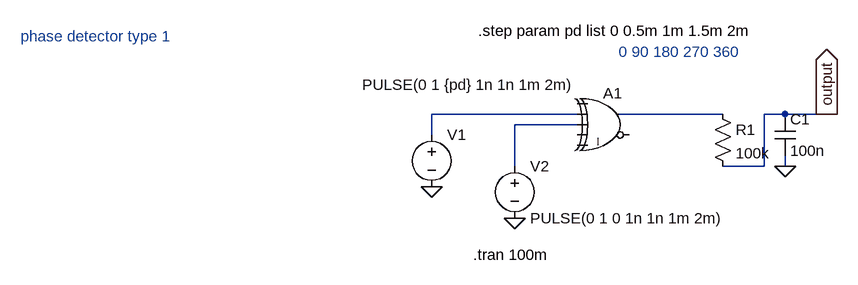
[diagram p0: schematic phasedetector1.asc]
phasedetector1.asc, the LTspice schematic file:
Version 4
SHEET 1 880 680
WIRE 160 128 -64 128
WIRE 384 128 224 128
WIRE 480 128 448 128
WIRE 544 128 480 128
WIRE 560 128 544 128
WIRE 160 144 64 144
WIRE -64 160 -64 128
WIRE 64 208 64 144
WIRE 448 208 448 128
WIRE 448 208 384 208
WIRE 480 208 480 192
FLAG 480 208 0
FLAG 544 128 output
IOPIN 544 128 Out
FLAG -64 240 0
FLAG 64 288 0
SYMBOL Digital\\xor 208 80 R0
SYMATTR InstName A1
SYMBOL voltage -64 144 R0
WINDOW 3 -107 -61 Left 2
WINDOW 123 0 0 Left 0
WINDOW 39 0 0 Left 0
SYMATTR InstName V1
SYMATTR Value PULSE(0 1 {pd} 1n 1n 1m 2m)
SYMBOL voltage 64 192 R0
WINDOW 123 0 0 Left 0
WINDOW 39 0 0 Left 0
SYMATTR InstName V2
SYMATTR Value PULSE(0 1 0 1n 1n 1m 2m)
SYMBOL res 368 112 R0
SYMATTR InstName R1
SYMATTR Value 100k
SYMBOL cap 464 128 R0
SYMATTR InstName C1
SYMATTR Value 100n
TEXT 8 0 Left 2 !.step param pd list 0 0.5m 1m 1.5m 2m
TEXT 0 344 Left 2 !.tran 100m
TEXT -696 8 Left 2 ;phase detector type 1
TEXT 224 32 Left 2 ;0 90 180 270 360

The netlist it stands for:
* phasedetector1.asc
A1 0 N001 N003 0 0 0 N002 0 XOR
V1 N001 0 PULSE(0 1 {pd} 1n 1n 1m 2m)
V2 N003 0 PULSE(0 1 0 1n 1n 1m 2m)
R1 N002 output 100k
C1 output 0 100n
.step param pd list 0 0.5m 1m 1.5m 2m
.tran 100m
* phase detector type 1
* 0 90 180 270 360
.backanno
.end